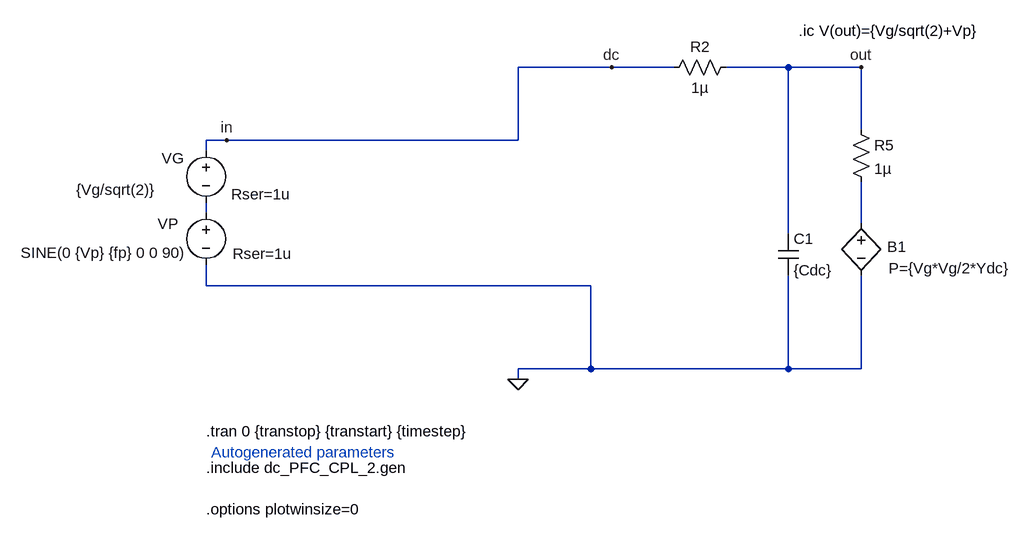
[diagram p0: schematic dc_PFC_CPL_2.asc]
dc_PFC_CPL_2.asc, the LTspice schematic file:
Version 4
SHEET 1 2640 776
WIRE 544 -480 400 -480
WIRE 640 -480 544 -480
WIRE 816 -480 720 -480
WIRE 928 -480 816 -480
WIRE 928 -384 928 -480
WIRE -48 -368 -80 -368
WIRE 400 -368 400 -480
WIRE 400 -368 -48 -368
WIRE -80 -352 -80 -368
WIRE -80 -256 -80 -272
WIRE 928 -240 928 -304
WIRE 816 -224 816 -480
WIRE -80 -144 -80 -176
WIRE 512 -144 -80 -144
WIRE 512 -16 512 -144
WIRE 512 -16 400 -16
WIRE 816 -16 816 -160
WIRE 816 -16 512 -16
WIRE 928 -16 928 -160
WIRE 928 -16 816 -16
WIRE 400 0 400 -16
FLAG 400 0 0
FLAG 544 -480 dc
FLAG 928 -480 out
FLAG -48 -368 in
SYMBOL voltage -80 -368 R0
WINDOW 123 0 0 Left 2
WINDOW 39 39 83 Left 2
WINDOW 3 -200 76 Left 2
WINDOW 0 -68 28 Left 2
SYMATTR SpiceLine Rser=1u
SYMATTR Value {Vg/sqrt(2)}
SYMATTR InstName VG
SYMBOL voltage -80 -272 R0
WINDOW 0 -74 33 Left 2
WINDOW 39 41 79 Left 2
WINDOW 3 -285 77 Left 2
WINDOW 123 0 0 Left 0
SYMATTR InstName VP
SYMATTR SpiceLine Rser=1u
SYMATTR Value SINE(0 {Vp} {fp} 0 0 90)
SYMBOL cap 800 -224 R0
SYMATTR InstName C1
SYMATTR Value {Cdc}
SYMATTR SpiceLine Rser=1u
SYMBOL res 624 -464 R270
WINDOW 0 32 56 VTop 2
WINDOW 3 0 56 VBottom 2
SYMATTR InstName R2
SYMATTR Value 1µ
SYMBOL bv 928 -256 R0
WINDOW 0 40 52 Left 2
WINDOW 3 42 85 Left 2
SYMATTR InstName B1
SYMATTR Value P={Vg*Vg/2*Ydc}
SYMBOL res 912 -400 R0
SYMATTR InstName R5
SYMATTR Value 1µ
TEXT -80 136 Left 2 !.include dc_PFC_CPL_2.gen
TEXT -72 112 Left 2 ;Autogenerated parameters
TEXT -80 80 Left 2 !.tran 0 {transtop} {transtart} {timestep}
TEXT 832 -536 Left 2 !.ic V(out)={Vg/sqrt(2)+Vp}
TEXT -80 200 Left 2 !.options plotwinsize=0

The netlist it stands for:
* dc_PFC_CPL_2.asc
VG in N001 {Vg/sqrt(2)} Rser=1u
VP N001 0 SINE(0 {Vp} {fp} 0 0 90) Rser=1u
C1 out 0 {Cdc} Rser=1u
R2 in out 1µ
B1 N002 0 P={Vg*Vg/2*Ydc}
R5 out N002 1µ
.include dc_PFC_CPL_2.gen
* Autogenerated parameters
.tran 0 {transtop} {transtart} {timestep}
.ic V(out)={Vg/sqrt(2)+Vp}
.options plotwinsize=0
.backanno
.end